# Altium schematic sheet Schematics.SchDoc
size 127 x 127 mm; SheetNumber: 1; SheetTotal: 1
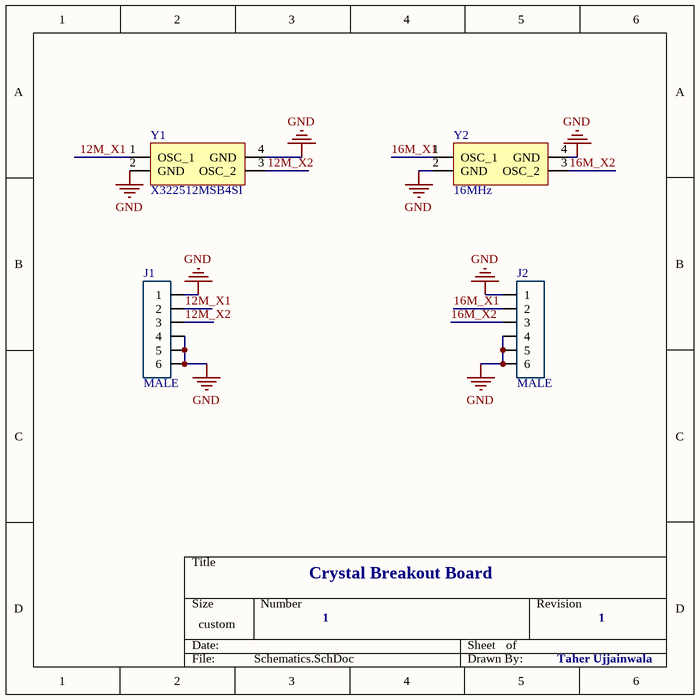
[diagram p0: Schematics.SchDoc]

## Parts
J1  MALE  [6_PIN_100MIL]
J2  MALE  [6_PIN_100MIL]
Y1  X322512MSB4SI  [Crystal resonator]
Y2  value 16MHz  [Crystal resonator]  (hidden comment: X322516MLB4SI)

## Nets
GND: J1.1 J1.4 J1.5 J1.6 J2.1 J2.4 J2.5 J2.6 Y1.2(GND) Y1.4(GND) Y2.2(GND) Y2.4(GND)
12M_X1: J1.2 Y1.1(OSC_1)
12M_X2: J1.3 Y1.3(OSC_2)
16M_X1: J2.2 Y2.1(OSC_1)
16M_X2: J2.3 Y2.3(OSC_2)

## Notes on the sheet
- Crystal Breakout Board
- 1
- Taher Ujjainwala

## Library data of the parts
J1 J2 = JF_6_PIN_MALE: Male header- 6 pin 1 row- through Hole; LCSC Part#: C37208; Datasheet: https://datasheet.lcsc.com/szlcsc/1810312320_BOOMELE-Boom-Precision-Elec-C37208_C37208.pdf; Type: Extended; Value: MALE
Y1 = X_12MHz_Res: SMD Crystal Resonators 12MHz ±10ppm SMD-3225_4P RoHS; LCSC Part#: C9002; MFR Part #: X322512MSB4SI; Value: 12MHz; Type: Basic; Datasheet: https://datasheet.lcsc.com/szlcsc/Yangxing-Tech-X322512MSB4SI_C9002.pdf
Y2 = X_16Mhz_Res: ±10ppm 16000000Hz -40℃~85℃ 贴片无源晶振 60Ω 9pF SMD3225-4P Crystals ROHS; LCSC Part#: C13738; MFR Part #: X322516MLB4SI; Type: Basic